# EAGLE design D2PChannelDrivers (EAGLE 5.10)
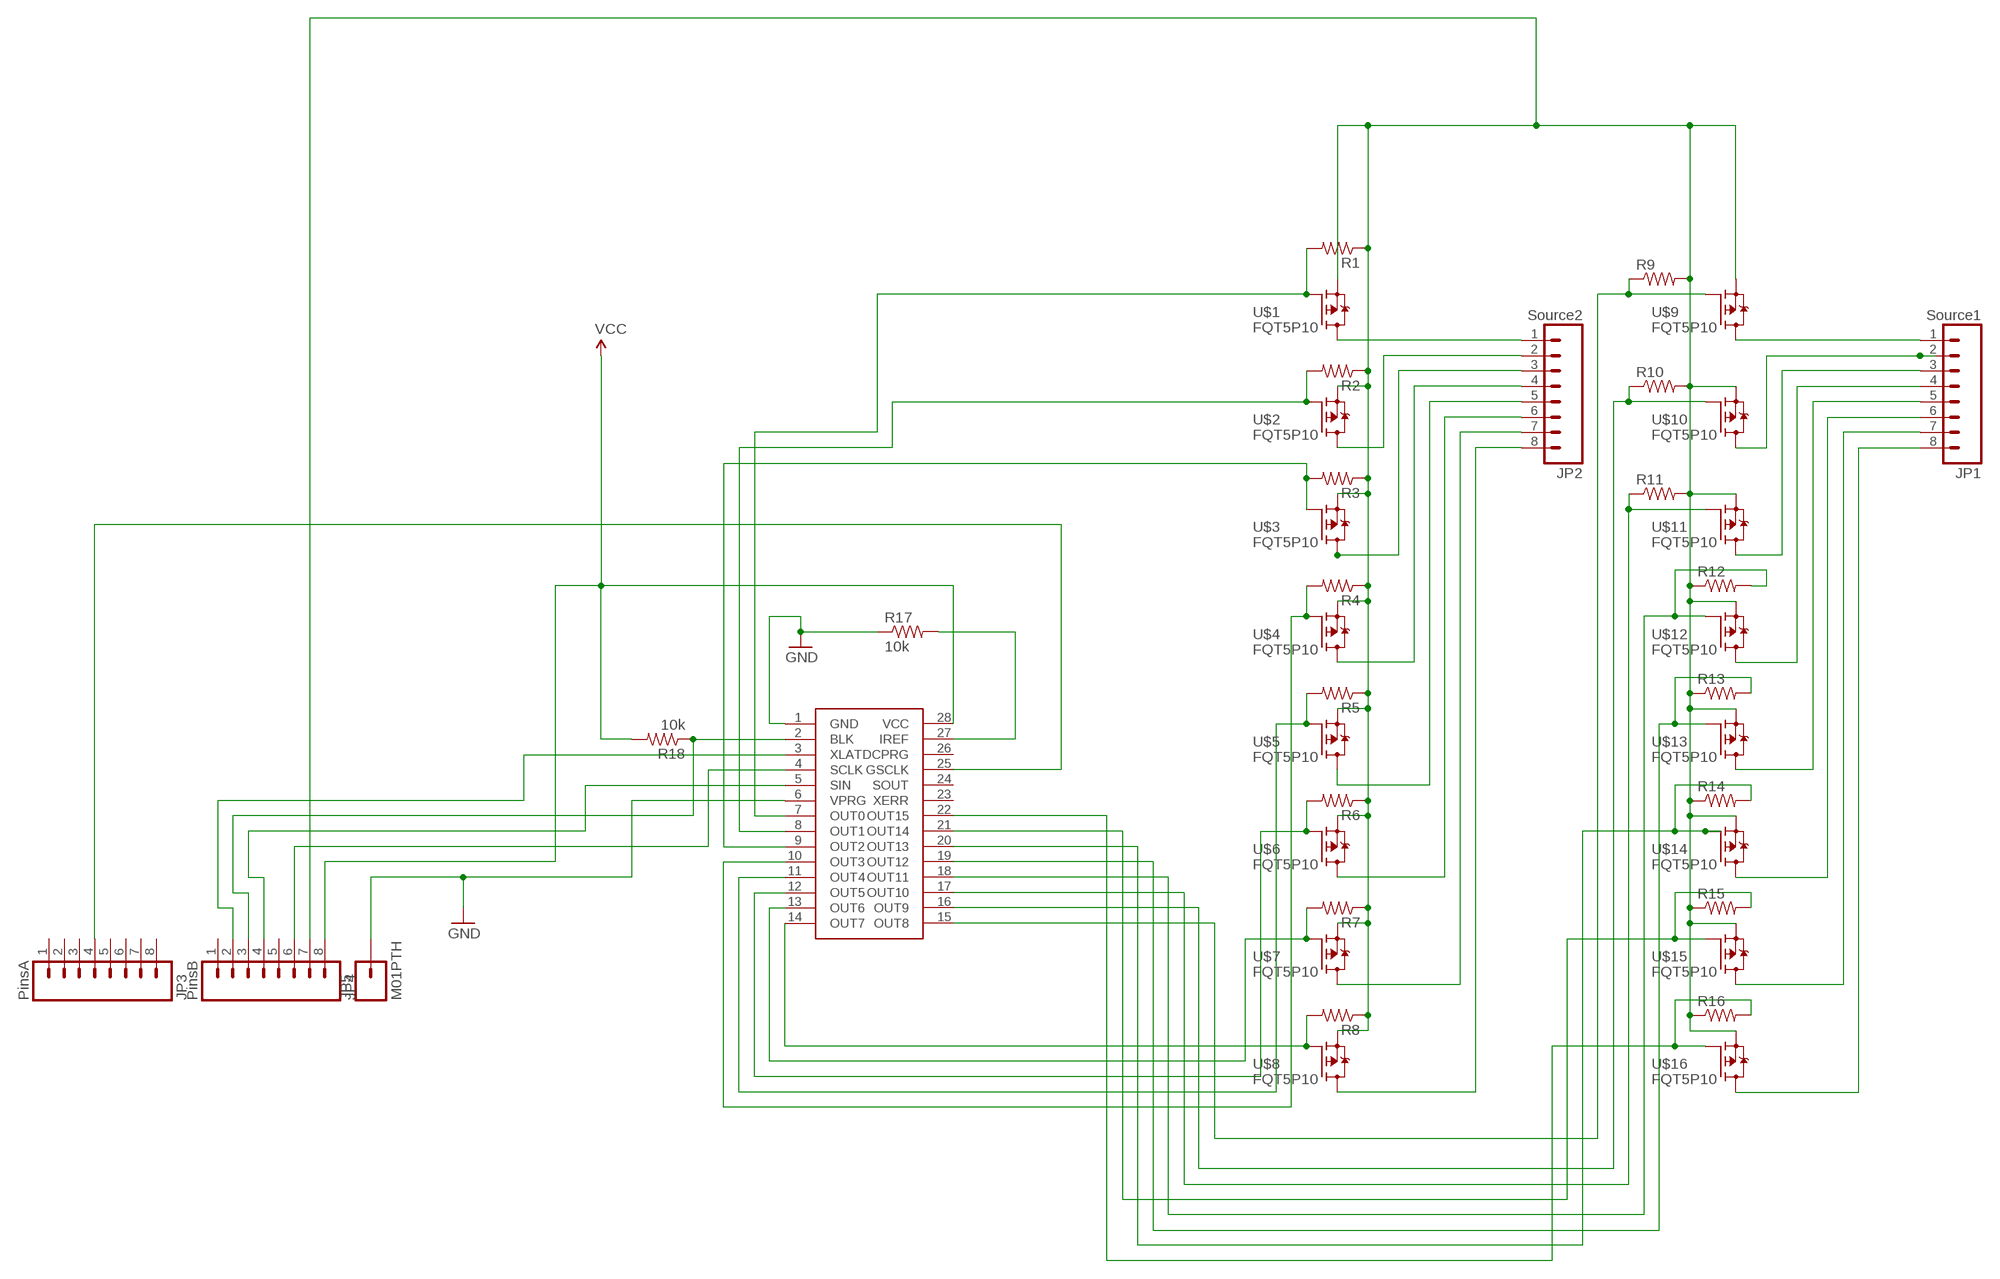
[diagram p0: schematic, sheet 1]

## Parts
JP1  Source1  M08  [1X08]
JP2  Source2  M08  [1X08]
JP3  PinsA  M08  [1X08]
JP4  PinsB  M08  [1X08]
JP5  M01PTH  [1X01]
R1  RESISTOR0402-RES  [0402-RES]
R2  RESISTOR0402-RES  [0402-RES]
R3  RESISTOR0402-RES  [0402-RES]
R4  RESISTOR0402-RES  [0402-RES]
R5  RESISTOR0402-RES  [0402-RES]
R6  RESISTOR0402-RES  [0402-RES]
R7  RESISTOR0402-RES  [0402-RES]
R8  RESISTOR0402-RES  [0402-RES]
R9  RESISTOR0402-RES  [0402-RES]
R10  RESISTOR0402-RES  [0402-RES]
R11  RESISTOR0402-RES  [0402-RES]
R12  RESISTOR0402-RES  [0402-RES]
R13  RESISTOR0402-RES  [0402-RES]
R14  RESISTOR0402-RES  [0402-RES]
R15  RESISTOR0402-RES  [0402-RES]
R16  RESISTOR0402-RES  [0402-RES]
R17  10k  RESISTORAXIAL-0.3  [AXIAL-0.3]
R18  10k  RESISTORAXIAL-0.3  [AXIAL-0.3]
U$1  FQT5P10  [SOT223]
U$2  FQT5P10  [SOT223]
U$3  FQT5P10  [SOT223]
U$4  FQT5P10  [SOT223]
U$5  FQT5P10  [SOT223]
U$6  FQT5P10  [SOT223]
U$7  FQT5P10  [SOT223]
U$8  FQT5P10  [SOT223]
U$9  FQT5P10  [SOT223]
U$10  FQT5P10  [SOT223]
U$11  FQT5P10  [SOT223]
U$12  FQT5P10  [SOT223]
U$13  FQT5P10  [SOT223]
U$14  FQT5P10  [SOT223]
U$15  FQT5P10  [SOT223]
U$16  FQT5P10  [SOT223]
U$17  TLC5940  [TSSOP28-GROUNDPAD]

## Nets
BLANK [signal]: JP4.3 R18.P$1 U$17.2(BLK)
GND: JP5.1 R17.P$1 U$17.1(GND) U$17.6(VPRG)
N$1 [signal]: JP3.4 U$17.25(GSCLK)
N$2: R17.P$2 U$17.27(IREF)
N$9: JP2.1 U$1.2(D)
N$10: JP2.2 U$2.2(D)
N$11: JP2.3 U$3.2(D)
N$12: JP2.4 U$4.2(D)
N$13: JP2.5 U$5.2(D)
N$14: JP2.6 U$6.2(D)
N$15: JP2.7 U$7.2(D)
N$16: JP2.8 U$8.2(D)
N$26: JP1.1 U$9.2(D)
N$27: JP1.2 U$10.2(D)
N$28: JP1.3 U$11.2(D)
N$29: JP1.4 U$12.2(D)
N$30: JP1.5 U$13.2(D)
N$31: JP1.6 U$14.2(D)
N$32: JP1.7 U$15.2(D)
N$62: JP1.8 U$16.2(D)
OUT0 [signal]: R1.2 U$1.1(G) U$17.7(OUT0)
OUT1 [signal]: R2.2 U$2.1(G) U$17.8(OUT1)
OUT2 [signal]: R3.2 U$3.1(G) U$17.9(OUT2)
OUT3 [signal]: R4.2 U$4.1(G) U$17.10(OUT3)
OUT4 [signal]: R5.2 U$5.1(G) U$17.11(OUT4)
OUT5 [signal]: R6.2 U$6.1(G) U$17.12(OUT5)
OUT6: R7.2 U$7.1(G) U$17.13(OUT6)
OUT7 [signal]: R8.2 U$8.1(G) U$17.14(OUT7)
OUT8 [signal]: R9.1 U$9.1(G) U$17.15(OUT8)
OUT9 [signal]: R10.1 U$10.1(G) U$17.16(OUT9)
OUT10 [signal]: R11.1 U$11.1(G) U$17.17(OUT10)
OUT11 [signal]: R12.2 U$12.1(G) U$17.18(OUT11)
OUT12 [signal]: R13.2 U$13.1(G) U$17.19(OUT12)
OUT13: R14.2 U$14.1(G) U$17.20(OUT13)
OUT14 [signal]: R15.2 U$15.1(G) U$17.21(OUT14)
OUT15 [signal]: R16.2 U$16.1(G) U$17.22(OUT15)
SCLK [signal]: JP4.6 U$17.4(SCLK)
SIN [signal]: JP4.4 U$17.5(SIN)
VCC [signal]: JP4.8 R18.P$2 U$17.28(VCC)
VLED: JP4.7 R1.1 R2.1 R3.1 R4.1 R5.1 R6.1 R7.1 R8.1 R9.2 R10.2 R11.2 R12.1 R13.1 R14.1 R15.1 R16.1 U$1.3(S) U$2.3(S) U$3.3(S) U$4.3(S) U$5.3(S) U$6.3(S) U$7.3(S) U$8.3(S) U$9.3(S) U$10.3(S) U$11.3(S) U$12.3(S) U$13.3(S) U$14.3(S) U$15.3(S) U$16.3(S)
XLAT [signal]: JP4.2 U$17.3(XLAT)
Unconnected: JP3.1 JP3.2 JP3.3 JP3.5 JP3.6 JP3.7 JP3.8 JP4.1 JP4.5 U$17.23(XERR) U$17.24(SOUT) U$17.26(DCPRG)

## Library data of the parts
JP1-JP4 = SparkFun:M08: Header 8 Standard 8-pin 0.1" header. Use with straight break away headers (SKU : PRT-00116), right angle break away headers (PRT-00553), swiss pins (PRT-00743), machine pins (PRT-00117), and female headers (PRT-00115).
JP5 = SparkFun:M01: Header 1 Standard 1-pin 0.1" header. Use with straight break away headers (SKU : PRT-00116), right angle break away headers (PRT-00553), swiss pins (PRT-00743), machine pins (PRT-00117), and female headers (PRT-00115).
R1-R18 = SparkFun:RESISTOR: Resistor Basic schematic elements and footprints for 0603, 1206, and PTH resistors.
U$1-U$16 = transistor-fet:FQT5P10
U$17 = SparkFun:TLC5940

## Net classes
0 default: width 0.381 mm, drill 0.381 mm, clearance 0.203 mm
1 signal: width 0.203 mm, drill 0.381 mm, clearance 0.203 mm
2 large: width 0.381 mm, drill 0.381 mm, clearance 0.203 mm

## Board
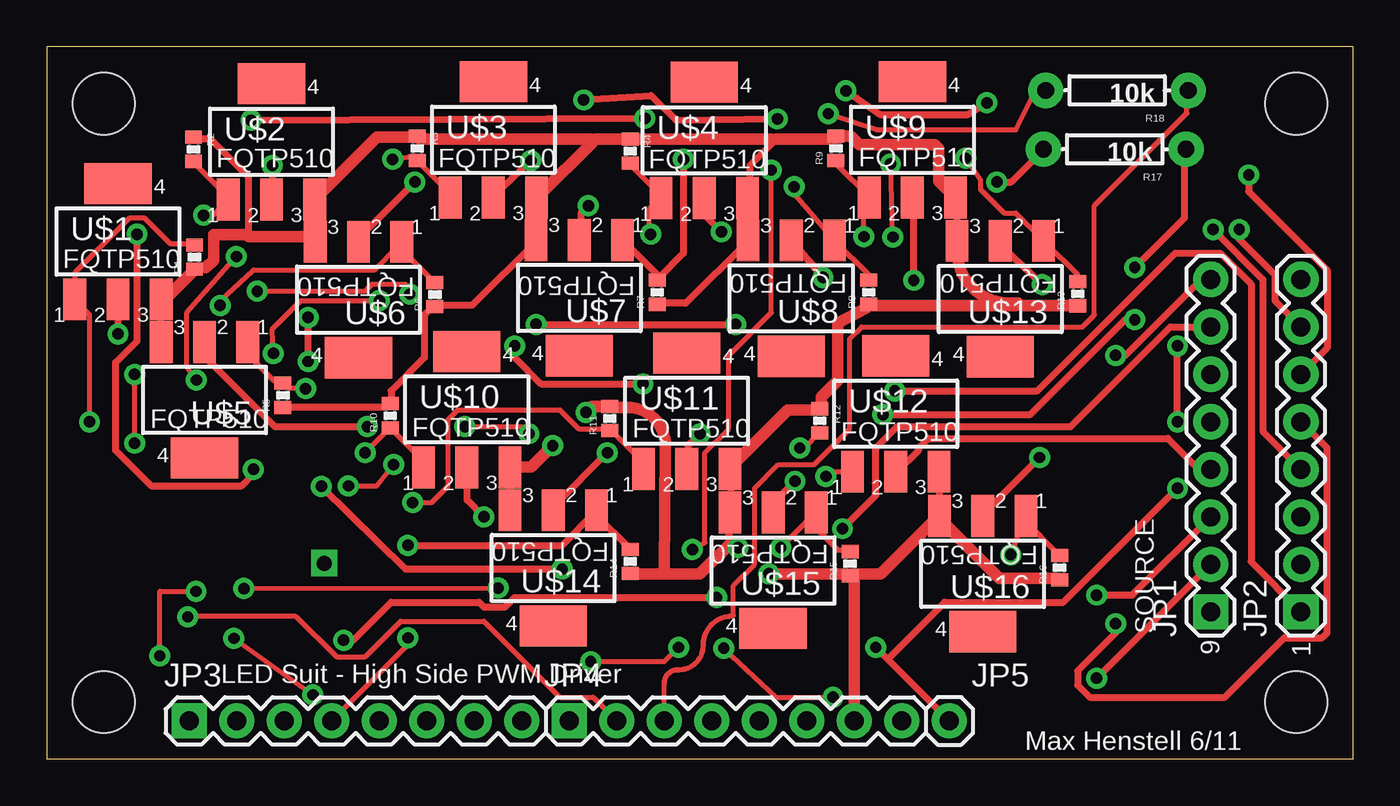
[diagram p1: board, top side]
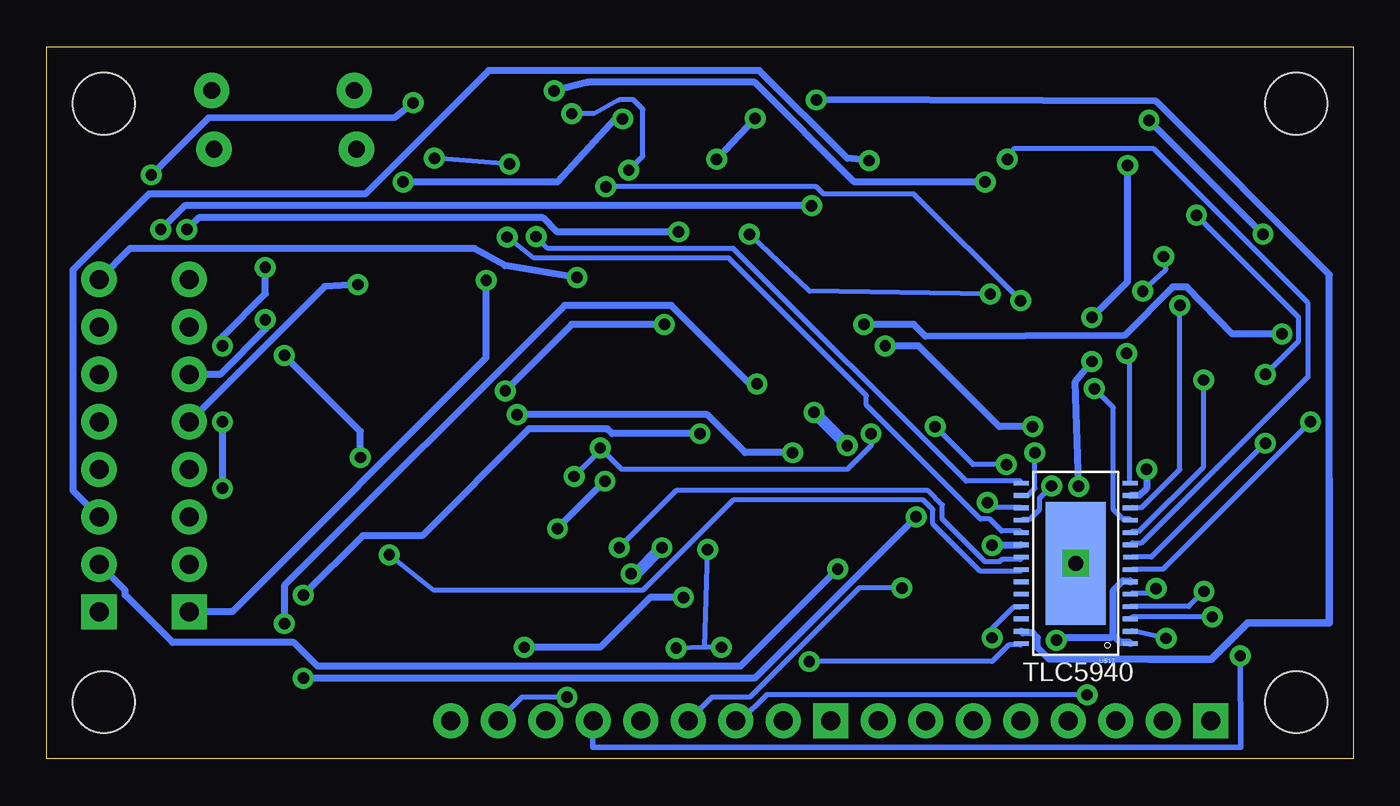
[diagram p2: board, bottom side, seen from below]

Size 69.85 x 38.1 mm. Coordinates in mm from the lower left corner, seen from the top.
Outline: 0,0 69.85,0 69.85,38.1 0,38.1 0,0
Copper layers (1*16): Top 0.035mm / dielectric 1.5mm / Bottom 0.035mm
Design rules "SparkFun": minimum track width 8mil, minimum drill 20mil, track to track 8mil, track to pad 8mil, pad to pad 8mil, via to via 8mil, smd to smd 8mil, copper to edge 10mil, drill to drill 8mil, minimum pad ring 12mil, minimum via ring 10mil, stop-mask expansion 4mil, vias tented up to drill 25mil, thermal gap 10mil

### Footprints (pad centres in the part's own frame; a part is rotated, then mirrored left to right if it is on the bottom)
1X08 = drill 1.016 pad 1.88 square: 1 0,0 | drill 1.016 pad 1.88 round: 2 2.54,0; 3 5.08,0; 4 7.62,0; 5 10.16,0; 6 12.7,0; 7 15.24,0; 8 17.78,0
1X01 = drill 1.016 pad 1.88 round: 1 0,0
0402-RES = smd 0.7 x 0.9: 1 -0.65,0; 2 0.65,0
AXIAL-0.3 = drill 0.9 pad 1.88 round: P$1 -3.81,0; P$2 3.81,0
SOT223 = smd 1.219 x 2.235: 1 -2.311,-3.099; 2 0,-3.099; 3 2.311,-3.099 | smd 3.6 x 2.2: 4 0,3.099
TSSOP28-GROUNDPAD = smd 0.8 x 0.25: 1 -2.921,4.298; 2 -2.921,3.637; 3 -2.921,2.977; 4 -2.921,2.317; 5 -2.921,1.656; 6 -2.921,0.996; 7 -2.921,0.335; 8 -2.927,-0.325; 9 -2.921,-0.985; 10 -2.921,-1.646; 11 -2.921,-2.306; 12 -2.921,-2.967; 13 -2.921,-3.627; 14 -2.921,-4.287; 15 2.921,-4.287; 16 2.921,-3.627; 17 2.921,-2.967; 18 2.921,-2.306; 19 2.921,-1.646; 20 2.921,-0.985; 21 2.927,-0.325; 22 2.921,0.335; 23 2.921,0.996; 24 2.921,1.656; 25 2.921,2.317; 26 2.921,2.977; 27 2.921,3.637; 28 2.921,4.298 | smd 3.2 x 6.6: 29 0,0.005 | drill 0.8 square: P$1 0,0
STAND-OFF = hole 3.302: 0,0

### Placement (x,y rotation side)
JP1  62.23,7.87 90 top
JP2  67.06,7.87 90 top
JP3  7.62,2.03 0 top
JP4  27.94,2.03 0 top
JP5  48.26,2.03 0 top
R1  7.9,26.85 90 top
R2  7.85,32.61 270 top
R3  19.81,32.66 270 top
R4  31.19,32.51 270 top
R5  12.62,19.46 90 top
R6  20.75,24.84 90 top
R7  32.64,24.97 90 top
R8  43.94,24.97 90 top
R9  42.19,32.66 90 top
R10  18.36,18.36 90 top
R11  30.1,18.21 90 top
R12  41.33,18.08 270 top
R13  55.12,24.89 90 top
R14  31.19,10.57 90 top
R15  42.95,10.44 90 top
R16  54.15,10.24 90 top
R17  57.1,32.61 180 top
R18  57.23,35.76 180 top
U$1  3.81,27.69 0 top
U$2  12.01,33.02 0 top
U$3  23.88,33.12 0 top
U$4  35.15,33.1 0 top
U$5  8.43,19.2 180 top
U$6  16.66,24.56 180 top
U$7  28.47,24.66 180 top
U$8  39.8,24.64 180 top
U$9  46.28,33.12 0 top
U$10  22.45,18.69 0 top
U$11  34.21,18.62 0 top
U$12  45.39,18.47 0 top
U$13  50.98,24.61 180 top
U$14  27.08,10.21 180 top
U$15  38.84,10.08 180 top
U$16  50.04,9.91 180 top
U$17  14.83,10.46 180 bottom
U$18  [STAND-OFF]  3.05,35.05 0 top
U$19  [STAND-OFF]  3.05,3.05 0 top
U$20  [STAND-OFF]  66.8,35.05 0 top
U$21  [STAND-OFF]  66.8,3.05 0 top

### Tracks (layer width: path | path; a pad name or v marks a point on that pad's centre or on a via)
BLANK  (via drill 0.61)
  Top 0.254: v10.01,6.45 v14.22,3.43 | JP4.3 33.02,4.06 arc-90 33.73,4.78 33.81,4.78 arc90 35.1,6.07 35.1,6.1 arc-90 36.65,7.64 arc117 36.7,7.68 36.7,9.27 37.85,10.41 37.85,14.48 39.12,15.75 41.02,15.75 42.93,17.65 42.93,22.48 43.56,23.11 55.37,23.11 56.01,23.75 56.01,29.59 60.96,34.54 60.96,35.69 R18.P$1
  Bottom 0.254: v10.01,6.45 11.81,6.86 U$17.2 | v14.22,3.43 31.37,3.43 32.77,2.03 JP4.3
GND  (via drill 0.61)
  Top 0.381: v15.88,6.35 16.38,6.35 18.41,8.38 23.11,8.38 23.37,8.13 24.51,8.13 25.02,8.64 v35.81,8.64 | 44.96,5.33 JP5.1 | v44.32,5.97 44.96,5.33 | v58.17,26.29 60.83,28.96 60.83,32.51 R17.P$1 | v60.45,18.03 v60.45,22.1 | v60.45,14.48 54.36,8.38 48.01,8.38 44.96,5.33
  Bottom 0.381: 12.83,6.6 12.45,6.22 11.94,6.22 U$17.1 | 12.83,6.6 12.83,9.02 12.32,9.53 11.94,9.53 U$17.6 | v15.88,6.35 15.75,6.48 12.95,6.48 12.83,6.6 | v35.81,8.64 37.59,8.64 40.26,5.97 v44.32,5.97 | v58.17,26.29 58.17,24.89 60.45,22.61 v60.45,22.1 | v60.45,14.48 v60.45,18.03
N$1  (via drill 0.61)
  Top 0.254: v19.3,6.48 19.3,6.1 JP3.4
  Bottom 0.254: v19.3,6.48 19.3,6.99 18.16,8.13 17.78,8.13 U$17.25
N$2  (via drill 0.61)
  Top 0.381: v28.7,35.26 32.31,35.48 33.66,34.16 v39.06,34.24 | v50.8,30.86 51.56,30.86 53.21,32.51 R17.P$2
  Bottom 0.381: 10.92,5.33 16.26,5.33 16.89,5.97 16.89,6.48 17.14,6.73 17.65,6.73 U$17.27 | 1.27,14.99 1.27,25.91 10.54,35.18 v28.7,35.26 | v39.06,34.24 39.45,34.24 42.55,30.86 v50.8,30.86
  Bottom 0.406: 1.27,14.99 1.27,7.29 5.64,7.29 7.59,5.33 10.92,5.33
N$9  (via drill 0.61)
  Top 0.381: v26.16,23.24 v36.83,23.24 | v45.34,19.68 52.96,19.68 60.33,27.05 62.74,27.05 64.39,25.4 64.39,10.54 JP2.1 | v3.81,22.73 U$1.2
  Bottom 0.381: v3.81,22.73 6.48,22.73 8.89,25.25 9.65,25.25 12.22,22.66 22.86,22.61 23.5,23.24 v26.16,23.24 | v36.83,23.24 41.78,23.24 v45.34,19.68
N$10  (via drill 0.61)
  Top 0.381: v12.06,31.75 12.06,29.97 U$2.2 | v13.97,21.26 v13.97,23.62 | v14.68,14.58 19.18,10.16 v27.56,10.16
  Bottom 0.381: v12.06,31.75 12.06,25.53 v13.97,23.62 | v13.97,21.26 14.86,20.19 v14.68,14.58 | v27.56,10.16 32.77,4.95 55.37,4.95 56.64,6.22 63.12,6.22 65.66,8.76 65.66,9.02 JP2.2
N$11  (via drill 0.61)
  Top 0.381: v25.88,32 23.88,30.1 U$3.2
  Bottom 0.381: v25.88,32 27.05,32.13 31.75,36.83 46.23,36.83 52.83,30.23 64.39,30.23 68.45,26.16 68.45,14.35 JP2.3
N$12  (via drill 0.61)
  Top 0.381: v36.07,28.19 35.18,29.08 35.18,29.97 U$4.2 | v62.36,28.32 65.02,25.65 65.02,17.53 JP2.4
  Bottom 0.381: v36.07,28.19 42.55,28.19 43.31,28.96 61.72,28.96 v62.36,28.32
N$13  (via drill 0.61)
  Top 0.381: v17.14,17.78 12.19,17.78 8.51,21.46 8.51,22.23 U$5.2 | v25.02,22.1 25.02,21.46 26.42,20.07 v31.88,20.07 | v57.15,7.24 57.15,6.73 55.12,4.7 55.12,3.94 55.75,3.3 62.99,3.3 66.17,6.48 68.2,6.48 68.45,6.73 68.45,16.64 JP2.5
  Bottom 0.381: v17.14,17.78 18.92,17.78 23.24,22.1 v25.02,22.1 | v31.88,20.07 32.26,20.07 36.45,24.26 42.16,24.26 57.15,9.27 v57.15,7.24
N$14  (via drill 0.61)
  Top 0.381: v19.68,30.86 16.76,27.94 16.76,27.69 U$6.2 | v42.72,35.74 44.55,34.47 49.25,34.47 v50.27,35.1 | v64.26,31.24 64.26,30.35 68.45,26.16 68.45,21.97 JP2.6
  Bottom 0.381: v19.68,30.86 26.67,30.86 32,36.2 40.92,36.2 v42.72,35.74 | v50.27,35.1 51.23,34.31 61.21,34.29 v64.26,31.24
N$15  (via drill 0.61)
  Top 0.381: v28.96,29.59 28.57,29.21 28.57,27.81 U$7.2 | v63.75,28.32 63.75,27.81 65.66,25.91 65.66,24.51 JP2.7
  Bottom 0.381: v28.96,29.59 62.48,29.59 v63.75,28.32
N$16  (via drill 0.61)
  Top 0.381: v41.5,25.76 39.88,27.69 U$8.2
  Bottom 0.381: v41.5,25.76 45.34,26.39 46.99,27.3 65.41,27.3 JP2.8
N$26  (via drill 0.61)
  Top 0.381: v46.35,25.6 46.35,29.97 U$9.2
  Bottom 0.381: v46.35,25.6 46.35,21.46 59.94,7.87 JP1.1
N$27  (via drill 0.61)
  Top 0.381: v23.37,12.95 22.48,13.84 22.48,15.49 U$10.2 | v56.13,4.32 JP1.2
  Bottom 0.381: v23.37,12.95 32,4.32 v56.13,4.32
N$28  (via drill 0.61)
  Top 0.381: v34.92,17.4 34.29,16.76 34.29,15.62 U$11.2 | v56.13,8.76 58.04,8.76 JP1.3
  Bottom 0.381: v34.92,17.4 39.62,17.4 39.88,17.65 44.07,17.65 49.78,11.94 52.96,11.94 v56.13,8.76
N$29
  Top 0.381: JP1.4 61.59,15.49 59.94,17.14 47.12,17.14 46.61,16.64 46.61,16.51 45.47,15.37 U$12.2
N$30  (via drill 0.61)
  Top 0.381: v53.21,25.38 51.05,27.43 51.05,27.69 U$13.2
  Bottom 0.381: v53.21,25.38 54.99,25.27 JP1.5
N$31  (via drill 0.61)
  Top 0.381: v29.97,16.38 27.18,13.59 27.18,13.34 U$14.2 | v44.7,18.41 52.58,18.41 57.66,23.5 v58.17,23.5
  Bottom 0.381: v29.97,16.38 32.51,16.38 34.54,18.41 v44.7,18.41 | v58.17,23.5 58.17,22.99 60.58,20.57 JP1.6
N$32  (via drill 0.61)
  Top 0.381: v40.01,14.86 38.86,13.72 38.86,13.21 U$15.2 | v42.55,12.32 44.32,14.1 44.32,16.64 45.47,17.78 54.74,17.78 60.07,23.11 JP1.7
  Bottom 0.381: v40.01,14.86 v42.55,12.32
N$62  (via drill 0.61)
  Top 0.381: v53.09,16.13 50.04,13.08 U$16.2 | v57.15,21.59 57.66,21.59 61.72,25.65 JP1.8
  Bottom 0.381: v53.09,16.13 53.09,17.53 v57.15,21.59
OUT0  (via drill 0.61)
  Top 0.254: v2.29,18.03 2.29,23.75 1.52,24.51 U$1.1 1.52,24.64 1.52,26.04 4.45,28.96 5.21,28.96 6.6,27.56 7.87,27.56 R1.2
  Bottom 0.254: v2.29,18.03 10.16,10.16 11.81,10.16 U$17.7
OUT1  (via drill 0.61)
  Top 0.254: v4.7,16.89 v4.7,20.57 | v8.38,29.08 8.89,29.08 9.65,29.84 U$2.1 9.78,29.97 7.87,31.88 R2.2
  Bottom 0.254: v4.7,16.89 10.79,10.79 11.81,10.79 U$17.8 | v4.7,20.57 2.92,22.35 2.92,23.62 v8.38,29.08
OUT2  (via drill 0.61)
  Top 0.254: v18.49,32.08 19.68,32.26 19.81,32.13 R3.2 21.46,30.35 21.46,30.1 U$3.1
  Bottom 0.254: v18.49,32.08 18.16,32.64 10.67,32.64 2.41,24.38 2.41,20.45 11.3,11.56 11.81,11.56 U$17.9
OUT3  (via drill 0.61)
  Top 0.254: v8,20.27 7.49,20.95 7.49,23.88 v10.13,26.87 | v11.25,25.02 17.02,25.02 17.4,25.4 19.18,25.4 v19.41,24.87 | v32.28,28.07 32.13,29.34 32.77,29.97 U$4.1 32.89,30.1 31.24,31.75 R4.2
  Bottom 0.254: v8,20.27 8,15.62 11.43,12.19 11.81,12.19 U$17.10 | v10.13,26.87 10.03,26.16 v11.25,25.02 | v19.41,24.87 29.08,25.02 v32.28,28.07
OUT4  (via drill 0.61)
  Top 0.254: v13.84,19.81 12.95,19.81 12.7,20.07 R5.2 12.57,20.19 12.19,20.19 10.79,21.59 10.79,22.23 U$5.1
  Bottom 0.254: v13.84,19.81 12.83,18.8 12.83,13.34 12.32,12.83 11.94,12.83 U$17.11
OUT5  (via drill 0.61)
  Top 0.254: v9.27,24.26 9.27,24.51 11.05,26.16 17.53,26.16 18.8,27.43 | 18.8,27.43 18.92,27.56 U$6.1 18.8,27.43 | 18.8,27.43 20.7,25.53 R6.2
  Bottom 0.254: v9.27,24.26 9.27,15.49 11.3,13.46 11.81,13.46 U$17.12
OUT6  (via drill 0.61)
  Top 0.381: v11.05,15.49 11.05,15.24 10.41,14.61 5.59,14.61 3.68,16.51 3.68,21.21 4.83,22.35 v4.83,28.07 | v10.92,34.16 v31.98,34.27 | v34.04,32.08 34.04,27.05 32.64,25.65 R7.2 32.64,25.91 U$7.1
  Bottom 0.381: v11.05,15.49 11.05,14.48 11.43,14.1 11.81,14.1 U$17.13 | v4.83,28.07 v10.92,34.16 | v31.98,34.27 v34.04,32.08
OUT7  (via drill 0.61)
  Top 0.254: v12.12,21.69 12.06,22.99 13.59,24.51 v17.78,24.51 | v39.95,30.61 39.95,30.23 U$8.1 43.94,25.91 R8.2
  Bottom 0.254: v12.12,21.69 11.94,21.46 11.94,14.86 U$17.14 | v17.78,24.51 23.5,30.23 28.32,30.23 28.7,30.61 v39.95,30.61
OUT8  (via drill 0.61)
  Top 0.254: v43.69,27.94 43.69,29.72 43.94,29.97 U$9.1 43.94,30.1 42.29,31.75 42.29,32 R9.1
  Bottom 0.254: v43.69,27.94 43.05,27.3 33.15,27.3 20.7,14.86 17.78,14.86 U$17.15
OUT9  (via drill 0.61)
  Top 0.254: v17.02,16.38 18.29,17.65 R10.1 18.41,17.65 20.07,16 20.07,15.62 U$10.1
  Bottom 0.254: v17.02,16.38 17.02,14.48 17.4,14.1 17.65,14.1 U$17.16
OUT10  (via drill 0.61)
  Top 0.254: v19.56,13.72 20.57,13.72 21.46,14.61 21.46,18.16 21.97,18.67 27.43,18.67 28.45,17.65 30.1,17.65 | 30.1,17.65 31.88,15.88 31.88,15.62 U$11.1 | 30.1,17.65 R11.1
  Bottom 0.254: v19.56,13.72 19.3,13.46 17.78,13.46 U$17.17
OUT11  (via drill 0.61)
  Top 0.254: v16.13,14.61 17.65,14.61 v18.54,15.75 | v22.35,17.78 25.4,17.78 v25.78,17.4 | v40.26,16.64 40.51,16.64 41.27,17.4 R12.2 | v41.66,15.11 41.91,15.37 U$12.1
  Bottom 0.254: v16.13,14.61 16.76,13.97 16.76,13.34 17.27,12.83 17.65,12.83 U$17.18 | v18.54,15.75 20.32,15.75 v22.35,17.78 | v25.78,17.4 25.78,16.76 27.05,15.49 39.12,15.49 v40.26,16.64 40.26,16.51 v41.66,15.11
OUT12  (via drill 0.61)
  Top 0.254: v45.24,27.91 v45.11,31.83 | v49.12,32.13 49.91,30.99 49.91,30.48 51.18,29.21 51.82,29.21 53.21,27.81 U$13.1 53.34,27.69 55.12,25.91 R13.2
  Bottom 0.254: v45.24,27.91 43.81,26.8 33.4,26.8 26.04,19.43 26.04,18.92 19.94,12.83 19.43,12.83 18.8,12.19 17.78,12.19 U$17.19 | v45.11,31.83 v49.12,32.13
OUT13  (via drill 0.61)
  Top 0.381: v19.3,11.43 27.56,11.43 29.34,13.21 U$14.1 29.34,13.08 31.11,11.3 R14.2
  Bottom 0.381: v19.3,11.43 17.78,11.43 U$17.20
OUT14  (via drill 0.61)
  Top 0.254: v39.24,11.3 41.15,13.21 U$15.1 40.77,12.7 42.29,11.18 42.93,11.18 R15.2
  Bottom 0.254: v39.24,11.3 36.2,14.35 22.73,14.35 21.97,13.59 21.97,12.83 19.68,10.54 18.92,10.54 18.8,10.67 17.78,10.67 U$17.21
OUT15  (via drill 0.61)
  Top 0.254: v51.54,10.92 51.84,11.66 52.2,12.83 | 52.2,12.83 52.32,12.95 U$16.1 52.2,12.83 | 52.2,12.83 54.1,10.92 R16.2
  Bottom 0.254: v51.54,10.92 49.15,9.02 37.97,9.02 33.15,13.84 22.99,13.84 22.48,13.34 22.48,12.57 19.94,10.03 17.78,10.03 U$17.22
SCLK  (via drill 0.6)
  Top 0.254: v6.04,5.51 6.04,8.97 v7.98,8.97
  Bottom 0.254: U$17.4 8.79,8.15 v7.98,8.97
  Bottom 0.305: JP4.6 40.66,2.03 40.66,0.61 6.02,0.61 v6.04,5.51
SIN  (via drill 0.61)
  Top 0.254: v10.54,9.12 v24.13,9.14
  Bottom 0.254: v10.54,9.12 11.05,8.89 11.81,8.89 U$17.5 | v24.13,9.14 26.42,9.14 32.26,3.3 34.29,3.3 JP4.4
VCC  (via drill 0.61)
  Top 0.254: v29.08,5.21 33.02,5.21 v33.78,5.97 | v36.2,5.92 38.99,3.3 v42.04,3.3 | v41.78,34.52 44.4,33.66 51.82,33.66 52.83,35.69 53.34,35.69 R18.P$2 | v38.73,31.5 38.73,23.88 36.45,21.59 36.45,17.65 35.18,16.38 35.18,11.56 v34.52,11.2
  Bottom 0.254: v29.08,5.21 19.3,5.21 18.41,6.1 17.78,6.1 U$17.28 | 34.67,5.97 v36.2,5.92 | v33.78,5.97 34.67,5.97 | v42.04,3.3 44.45,3.3 JP4.8 | v41.78,34.52 40.59,34.52 39.24,35.26 38.48,35.26 37.97,34.75 37.97,32.26 v38.73,31.5 | 34.67,5.97 v34.52,11.2
VLED  (via drill 0.61)
  Top 0.381: 19.81,33.27 R3.1 19.94,33.15 | 14.35,29.97 U$2.3 14.22,29.84 14.22,28.07 U$6.3 14.35,27.69 14.1,27.94 | U$5.3 6.1,22.35 6.1,24.51 U$1.3 | R2.1 7.87,33.15 8.76,33.15 10.79,31.11 10.79,27.94 | U$1.3 6.22,24.64 | 29.34,33.15 29.21,33.02 29.08,33.15 | 31.11,33.15 R4.1 31.37,33.15 | 26.29,30.1 U$3.3 26.16,29.84 U$7.3 26.16,27.69 22.73,24.26 20.83,24.26 R6.1 20.57,24.13 20.19,23.75 20.19,21.46 18.41,19.68 18.41,19.18 R10.2 18.29,18.92 18.16,18.8 12.7,18.8 R5.1 | R15.1 43.05,9.91 | 47.62,12.95 U$16.3 | 54.1,9.65 R16.1 | U$16.3 47.75,12.83 | U$12.3 47.75,15.37 47.75,13.08 U$16.3 | R15.1 43.18,9.78 | 41.27,18.67 R12.1 41.4,18.8 | 36.58,15.62 U$11.3 36.58,15.37 36.58,13.34 U$15.3 36.45,13.08 36.45,11.43 36.58,11.3 | U$14.3 U$10.3 24.89,15.62 | 31.24,9.91 R14.1 | 30.1,18.8 R11.2 | R7.1 32.64,24.38 34.16,24.38 37.47,27.69 U$8.3 37.47,27.81 U$4.3 37.59,30.1 37.59,31.75 38.86,33.02 | 42.29,33.27 R9.2 42.16,33.15 | 52.07,24.26 51.94,24.38 51.82,24.26 | 55.12,24.26 R13.1 | 48.64,27.69 U$13.3 48.64,27.81 48.64,29.84 U$9.3 | 43.94,24.26 R8.1 43.81,24.13 | 38.86,33.02 38.99,33.15 | 42.8,9.91 R15.1 | 38.73,33.15 38.86,33.02 | 7.87,26.16 R1.1 8,26.29 8.51,26.29 | U$1.3 6.35,24.64
  Top 0.61: 19.81,33.27 17.65,33.27 14.35,29.97 | 14.1,27.94 10.79,27.94 10.69,28.04 8.94,28.04 8.91,28.02 8.91,26.7 8.51,26.29 | 29.34,33.15 31.11,33.15 | 29.21,33.02 26.29,30.1 | 19.94,33.15 29.08,33.15 | 43.05,9.91 44.58,9.91 47.62,12.95 | 54.1,9.65 50.93,9.65 47.75,12.83 | 43.18,9.78 JP4.7 | 41.27,18.67 39.62,18.67 36.58,15.62 | 33.02,9.91 34.92,9.91 36.45,11.43 | 33.02,9.91 31.24,9.91 | 33.02,9.91 33.07,16.79 arc90 31.06,18.8 30.1,18.8 | 24.89,15.62 25.91,15.62 v27.05,16.76 | 52.07,24.26 55.12,24.26 | 51.82,24.26 43.94,24.26 | 38.99,33.15 42.16,33.15 | 41.4,18.8 41.4,19.36 42.29,20.24 42.29,23.32 43.81,24.13 | v38.61,9.91 42.8,9.91 | 36.58,11.3 v36.96,11.3 | 31.37,33.15 38.73,33.15 | 6.35,24.64 7.87,26.16 | v28.83,18.54 29.15,18.86 R11.2 | 51.94,24.38 51.46,24.38 arc-90 48.69,27.15 48.69,27.69 arc90 U$13.3 | U$9.3 47.7,30.91 47.7,32.64 47.47,32.87 43.43,32.87 42.99,33.31 R9.2
  Bottom 0.381: 38.35,9.91 v38.61,9.91
  Bottom 0.61: v28.83,18.54 v27.05,16.76 | v36.96,11.3 38.35,9.91
XLAT  (via drill 0.6)
  Top 0.254: JP4.2 29.21,3.3 27.43,3.3 23.37,7.37 18.92,7.37 17.02,5.46 15.49,5.46 13.28,7.64 7.59,7.64 v7.54,7.59
  Bottom 0.254: 11.81,7.49 U$17.3 11.81,7.59 v7.54,7.59

### Text on the board
tPlace: FQTP510 | FQTP510 | FQTP510 | FQTP510 | FQTP510 | FQTP510 | FQTP510 | FQTP510 | FQTP510 | FQTP510 | FQTP510 | FQTP510 | FQTP510 | FQTP510 | FQTP510 | FQTP510 | SOURCE | 9 | LED Suit - High Side PWM Driver | 1 | Max Henstell 6/11
bPlace: TLC5940